# EAGLE design VGA2Scart (EAGLE 7.3.0)
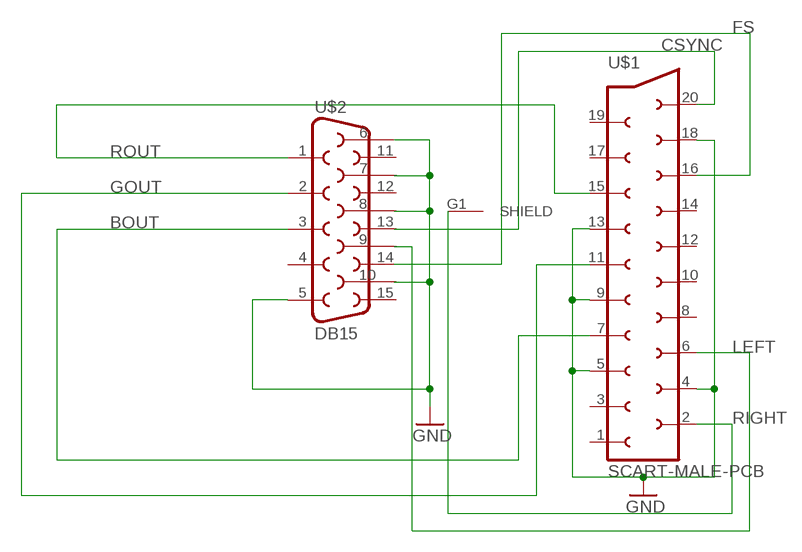
[diagram p0: schematic, sheet 1]

## Parts
U$1  SCART-MALE-PCB  [SCART-PCB]
U$2  DB15  [DB15]

## Nets
BOUT: U$1.7 U$2.3
CSYNC: U$1.20 U$2.13
FS: U$1.16 U$2.14
GND: U$1.4 U$1.5 U$1.9 U$1.13 U$1.18 U$2.5 U$2.6 U$2.7 U$2.8 U$2.10
GOUT: U$1.11 U$2.2
LEFT: U$1.6 U$2.9
RIGHT: U$1.2 U$2.G1(SHIELD)
ROUT: U$1.15 U$2.1
Unconnected: U$1.1 U$1.3 U$1.8 U$1.10 U$1.12 U$1.14 U$1.17 U$1.19 U$2.4 U$2.11 U$2.12 U$2.15

## Library data of the parts
U$1 = con-hirschmann:SCART-MALE-PCB
U$2 = SparkFun-Connectors:DB15: DB15 / VGA right angle through-hole female connector.

## Board
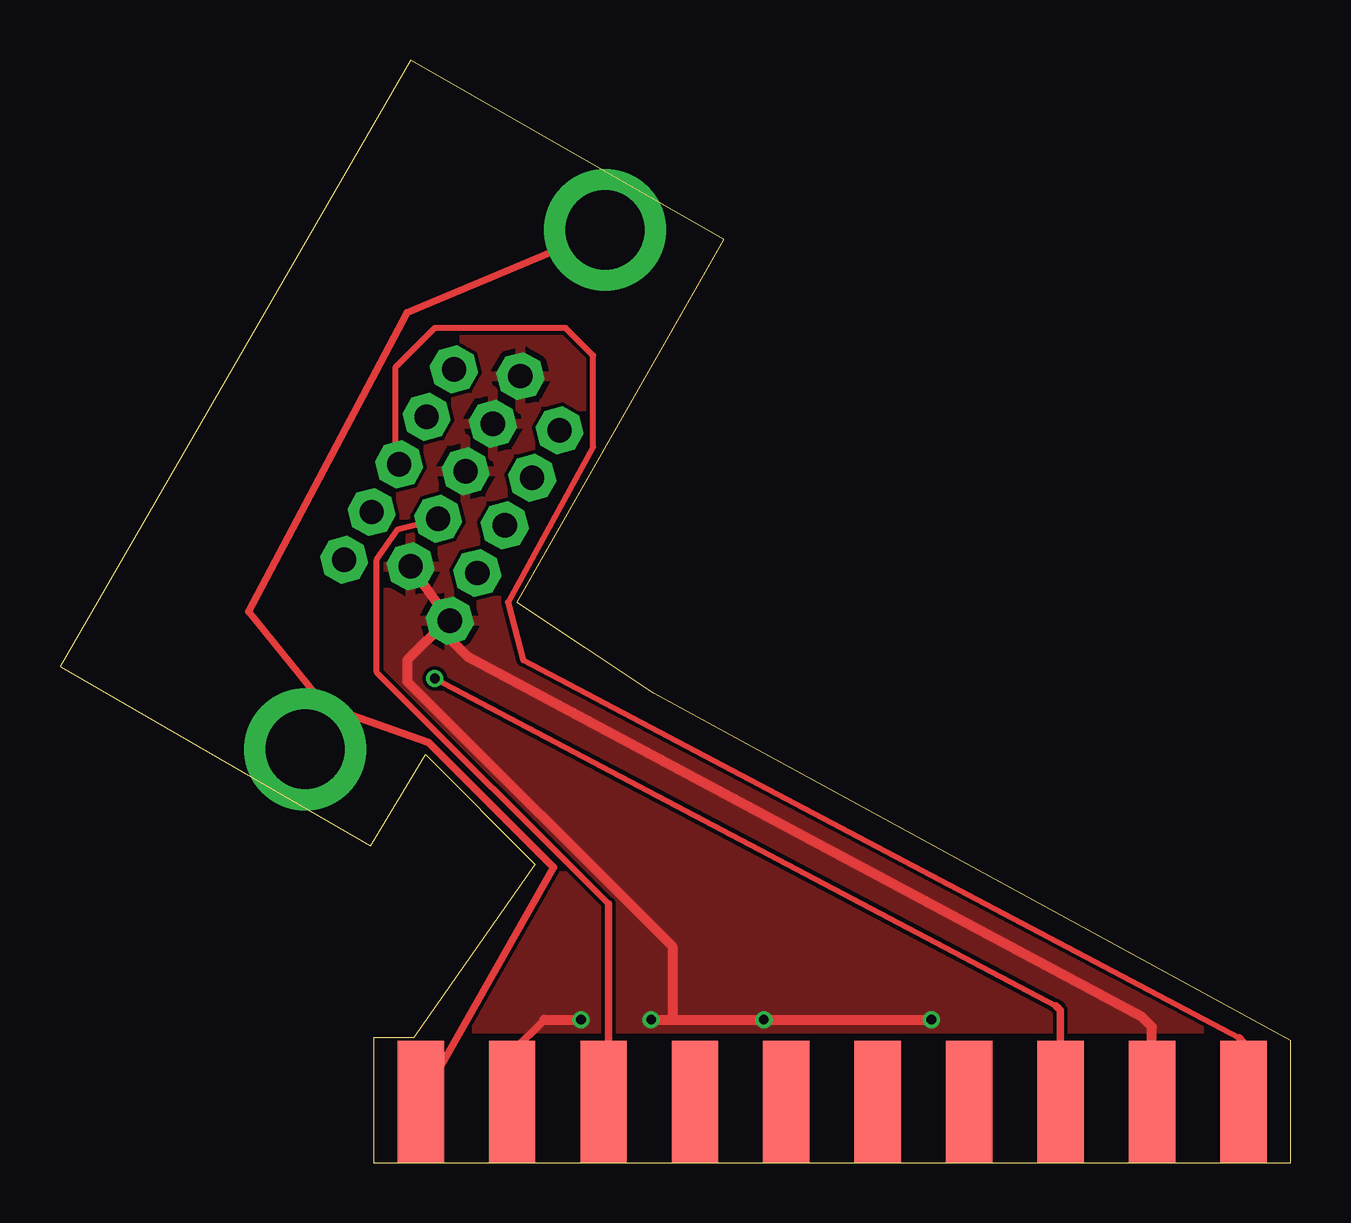
[diagram p1: board, top side]
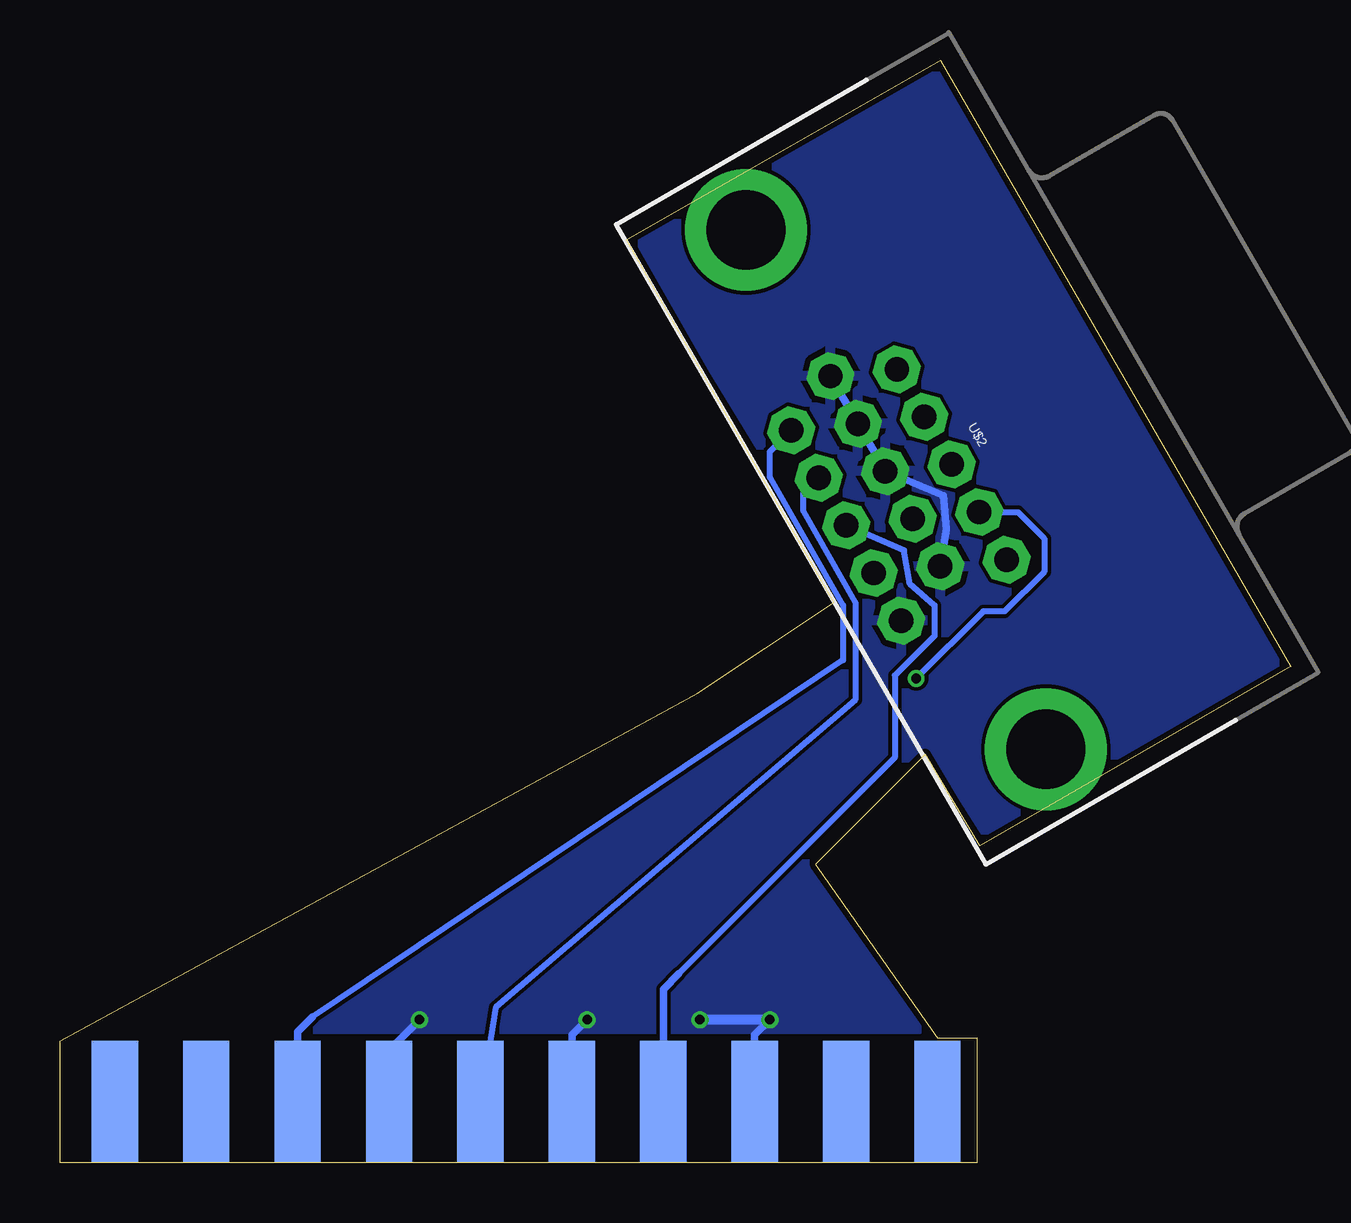
[diagram p2: board, bottom side, seen from below]

Size 51.31 x 45.97 mm. Coordinates in mm from the lower left corner, seen from the top.
Outline: 24.77,19.56 19.05,23.37 27.69,38.48 14.61,45.97 0,20.7 12.95,13.21 15.24,17.02 19.81,12.45 14.73,5.21 13.08,5.21 13.08,0 51.31,0 51.31,5.08 24.77,19.56
Copper layers (1*16): Top 0.035mm / dielectric 1.5mm / Bottom 0.035mm
Design rules "seedstudio_Fusion_eagle_rule_v1.1": minimum track width 6mil, minimum drill 12mil, track to track 6mil, track to pad 6mil, pad to pad 6mil, via to via 6mil, smd to smd 0mil, copper to edge 10mil, drill to drill 10mil, minimum pad ring 10mil, minimum via ring 6mil, stop-mask expansion 2mil, vias tented up to drill 100mil, thermal gap 10mil

### Footprints (pad centres in the part's own frame; a part is rotated, then mirrored left to right if it is on the bottom)
SCART-PCB = smd 1.93 x 5.08: 1 16.51,0; 3 12.7,0; 5 8.89,0; 7 5.08,0; 9 1.27,0; 11 -2.54,0; 13 -6.35,0; 15 -10.16,0; 17 -13.97,0; 19 -17.78,0 | smd 1.93 x 5.08 bottom: 2 16.205,0; 4 12.395,0; 6 8.585,0; 8 4.775,0; 10 0.965,0; 12 -2.845,0; 14 -6.655,0; 16 -10.465,0; 18 -14.275,0; 20 -18.085,0
DB15 = drill 1.016 pad 1.88 octagon: 1 -4.32,-7.62; 2 -2.03,-7.62; 3 0.26,-7.62; 4 2.55,-7.62; 5 4.84,-7.62; 6 -5.46,-5.08; 7 -3.17,-5.08; 8 -0.88,-5.08; 9 1.41,-5.08; 10 3.7,-5.08; 11 -4.32,-2.54; 12 -2.03,-2.54; 13 0.26,-2.54; 14 2.55,-2.54; 15 4.84,-2.54 | drill 3.302 pad 5.08: G1 -12.5,-5.08; G2 12.5,-5.08

### Placement (x,y rotation side)
U$1  31.24,2.54 0 bottom
U$2  12.06,30.61 300 bottom

### Tracks (layer width: path | path; a pad name or v marks a point on that pad's centre or on a via)
BOUT
  Bottom 0.254: U$2.3 16.13,25.53 15.88,24.13 14.86,23.24 14.86,21.97 16.51,20.32 16.51,16.89 25.53,7.87
  Bottom 0.305: U$1.7 26.16,7.24 25.53,7.87
CSYNC
  Top 0.254: U$2.13 13.97,29.28 13.97,33.15 15.62,34.8 21.08,34.8 22.23,33.66 22.23,29.84 18.67,23.37 19.3,20.95 49.15,5.21
  Top 0.305: U$1.20 49.33,5.03 49.15,5.21
FS  (via drill 0.4)
  Top 0.254: v15.62,20.19 41.52,6.55 41.66,6.48
  Top 0.305: U$1.16 41.71,6.36 41.52,6.55
  Bottom 0.254: U$2.14 11.38,27.13 10.29,26.04 10.29,24.64 11.94,22.99 12.83,22.99 v15.62,20.19
GND  (via drill 0.4)
  Top 0.305: U$1.4 18.85,4.62 20.19,5.97
  Top 0.406: U$2.10 U$2.5 | U$2.5 16.13,22.61 14.48,20.95 14.48,20.07 25.53,9.02 25.53,6.1 25.65,5.97 | v24.64,5.97 25.65,5.97 | 25.65,5.97 v29.34,5.97 v36.32,5.97 | U$2.5 16.24,21.86 17.02,21.08 45.09,6.1 45.52,5.66 U$1.18 | 20.19,5.97 v21.72,5.97
  Bottom 0.305: U$2.10 14.35,26.42 14.48,27.81 U$2.8 U$2.7 U$2.6 | U$1.5 22.35,5.33 v21.72,5.97 | U$1.13 37.59,4.7 v36.32,5.97 | U$1.9 29.97,5.33 v29.34,5.97
  Bottom 0.406: v21.72,5.97 v24.64,5.97
  pour Top: 14.73,45.59 27.3,38.35 18.16,23.37 24.51,19.18 49.15,5.59 15.49,5.59 20.19,12.45 15.11,17.53 12.7,13.72 0.38,20.83
  pour Bottom: 14.73,45.59 27.3,38.35 18.16,23.37 24.51,19.18 49.15,5.59 15.49,5.59 20.19,12.45 15.11,17.53 12.7,13.72 0.38,20.83
GOUT
  Bottom 0.254: U$2.2 20.32,27.91 20.32,27.18 18.16,23.37 18.16,19.3 33.15,6.48 U$1.11
LEFT
  Top 0.254: U$2.9 14.1,26.42 13.21,25.15 13.21,20.45 22.86,10.79
  Top 0.305: 22.86,10.79 22.86,4.27 U$1.6
RIGHT
  Top 0.305: U$2.G1 14.48,35.43 7.87,22.99 11.05,19.05 15.37,17.53 20.57,12.32 U$1.2
ROUT
  Bottom 0.254: U$2.1 21.72,29.64 21.72,28.57 18.67,23.24 18.67,20.95 40.77,6.1
  Bottom 0.305: U$1.15 41.4,5.46 40.77,6.1

### Text on the board
201bmp: C:/Users/rodriguj/Documents/zxspectrum/zxuno/repositorio/hardware/otros/zxuno2scart/silueta.bmp